# Altium project PCB_Project.PrjPcb
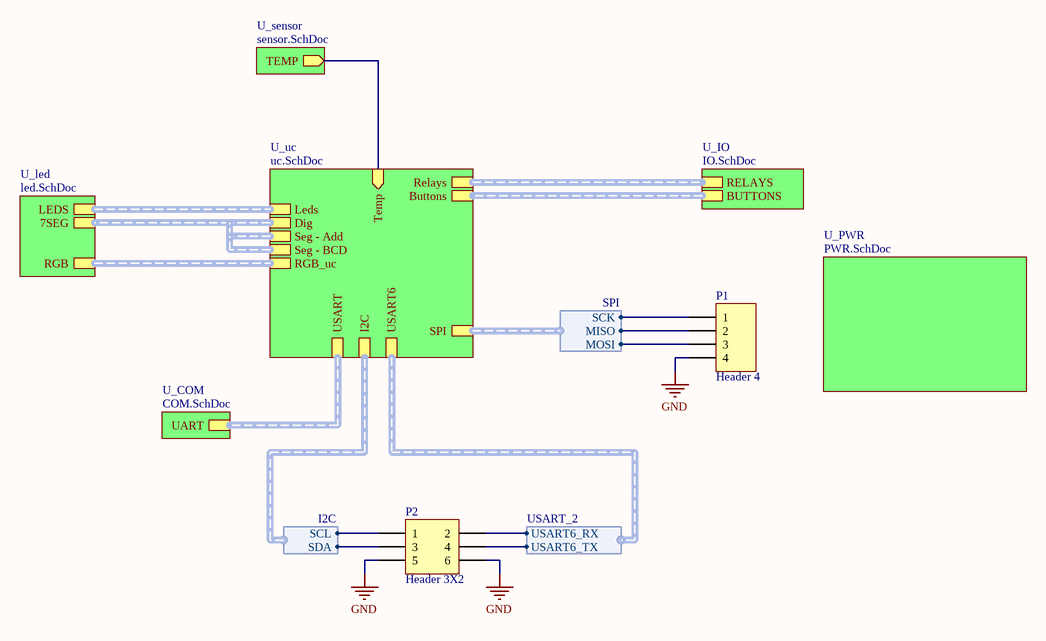
[diagram p0: extension.SchDoc]
7 sheets, 166 parts. Net scope: hierarchical (ports join the sheet entries above them; power ports are global).
Board file: extensionV1.0.PcbDoc
Sheets:
  extension.SchDoc
    U_IO = IO.SchDoc
    U_led = led.SchDoc
    U_COM = COM.SchDoc
    U_uc = uc.SchDoc
    U_sensor = sensor.SchDoc
    U_PWR = PWR.SchDoc

## Sheet extension.SchDoc
size A3

### Parts
P1  Header 4  [HDR1X4]
P2  Header 3X2  [HDR2X3]

### Sub-sheets
U_COM = COM.SchDoc: UART (harness UART)
U_IO = IO.SchDoc: RELAYS (harness Relays), BUTTONS (harness Buttons)
U_led = led.SchDoc: LEDS (harness LEDS), 7SEG (harness 7SEG), RGB (harness RGB)
U_PWR = PWR.SchDoc: no entries
U_sensor = sensor.SchDoc: TEMP (out)
U_uc = uc.SchDoc: USART (harness USART), Leds (harness Leds), Relays (harness Relays), Buttons (harness Buttons), Dig (harness DIG), Seg - Add (harness Seg Add), Seg - BCD (harness Seg BCD), I2C (harness I2C), SPI (harness SPI), USART6 (harness USART_2), RGB_uc (harness RGB), Temp (in)

### Harnesses
USART_2: USART6_TX, USART6_RX
SPI: MOSI, MISO, SCK
I2C: SDA, SCL

### Nets
GND: P1.4 P2.5 P2.6
MISO: P1.2 ; sheet U_uc/SPI.MISO
MOSI: P1.3 ; sheet U_uc/SPI.MOSI
SCK: P1.1 ; sheet U_uc/SPI.SCK
SCL: P2.1 ; sheet U_uc/I2C.SCL
SDA: P2.3 ; sheet U_uc/I2C.SDA
TEMP: sheet U_uc/Temp, sheet U_sensor/TEMP
USART6_RX: P2.2 ; sheet U_uc/USART6.USART6_RX
USART6_TX: P2.4 ; sheet U_uc/USART6.USART6_TX

### Buses and harness runs
harness sheet U_COM/UART = sheet U_uc/USART
harness sheet U_IO/BUTTONS = sheet U_uc/Buttons
harness sheet U_IO/RELAYS = sheet U_uc/Relays
harness sheet U_led/7SEG = sheet U_uc/Dig = sheet U_uc/Seg - Add = sheet U_uc/Seg - BCD
harness sheet U_led/LEDS = sheet U_uc/Leds
harness sheet U_led/RGB = sheet U_uc/RGB_uc

### Notes on the sheet
- 1
- 2
- 3
- 4
- 5
- 6
- 7
- 8
- A
- B
- C
- D
- Project:
- Date:
- Drawing number:
- Rev:
- Format:
- A3
- Drawn by:
- Laboratory:
- Page
- Sheet:
- of
- File:

### Library data of the parts
P1 = Header 4: Header, 4-Pin
P2 = Header 3X2: Header, 3-Pin, Dual row

## Sheet IO.SchDoc
size A3
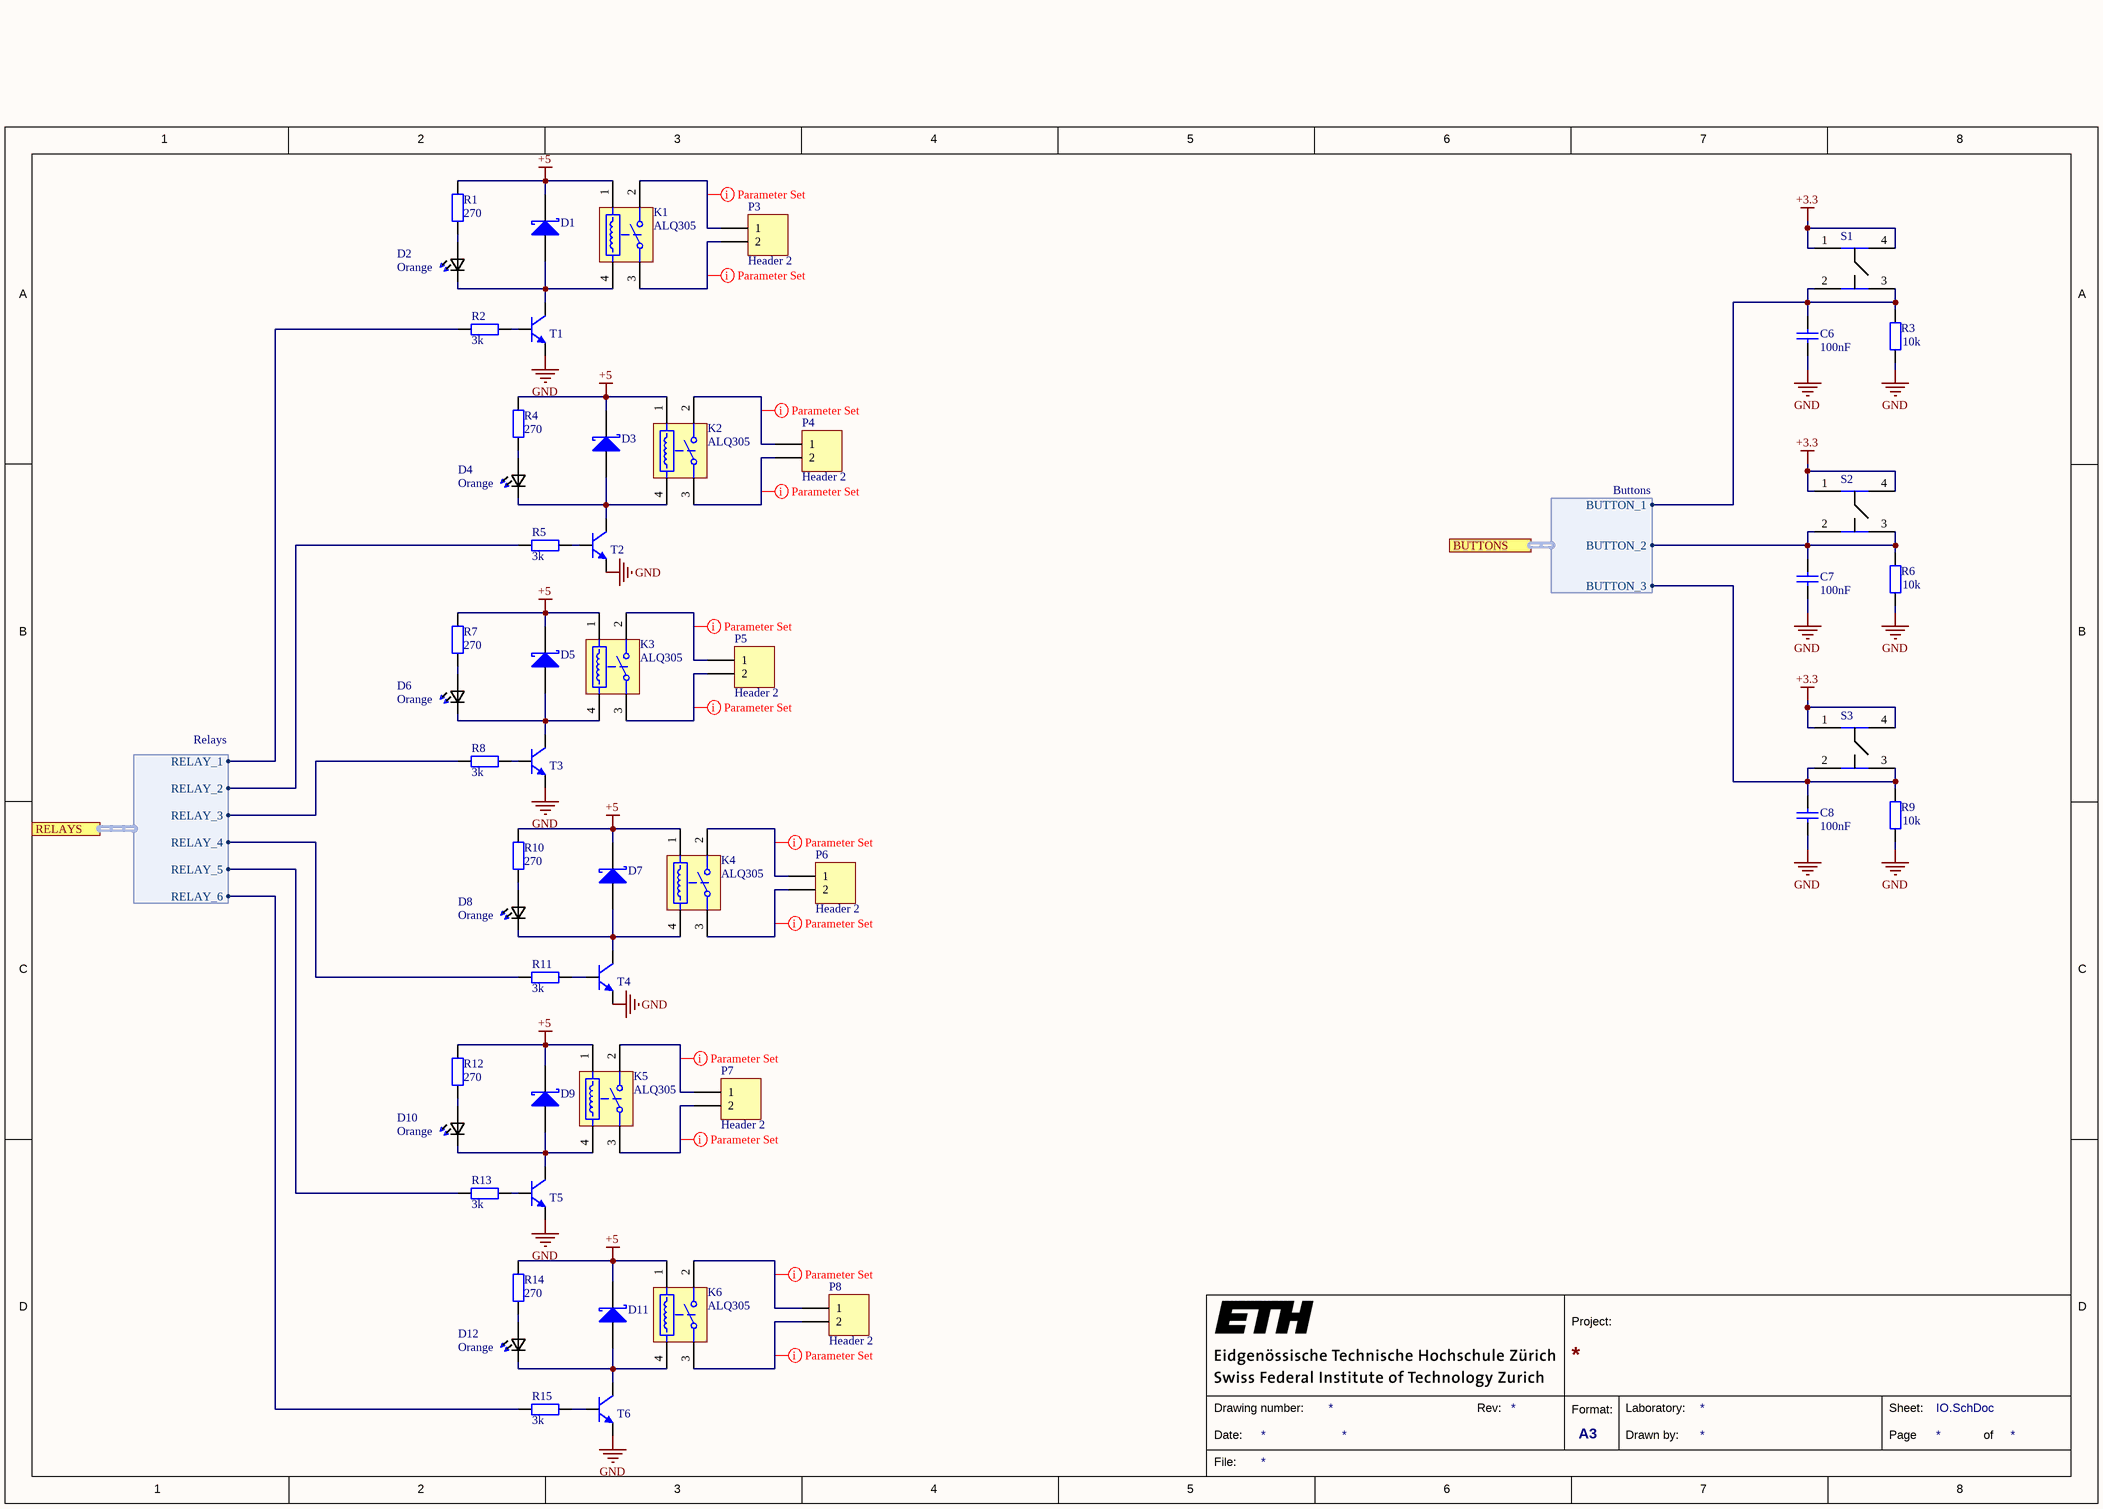
[diagram p1: IO.SchDoc]

### Parts
C6  100nF  [CAP_0603i_1608m -N]
C7  100nF  [CAP_0603i_1608m -N]
C8  100nF  [CAP_0603i_1608m -N]
D1  Diode  Schottky  [SOD123]  (value not drawn)
D2  Orange  [*0603]
D3  Diode  Schottky  [SOD123]  (value not drawn)
D4  Orange  [*0603]
D5  Diode  Schottky  [SOD123]  (value not drawn)
D6  Orange  [*0603]
D7  Diode  Schottky  [SOD123]  (value not drawn)
D8  Orange  [*0603]
D9  Diode  Schottky  [SOD123]  (value not drawn)
D10  Orange  [*0603]
D11  Diode  Schottky  [SOD123]  (value not drawn)
D12  Orange  [*0603]
K1  ALQ305  [PNSC-LQ-4-2000x1000x1600_V]
K2  ALQ305  [PNSC-LQ-4-2000x1000x1600_V]
K3  ALQ305  [PNSC-LQ-4-2000x1000x1600_V]
K4  ALQ305  [PNSC-LQ-4-2000x1000x1600_V]
K5  ALQ305  [PNSC-LQ-4-2000x1000x1600_V]
K6  ALQ305  [PNSC-LQ-4-2000x1000x1600_V]
P3  Header 2  [3.5MM Phoenix Contact 1984617]
P4  Header 2  [3.5MM Phoenix Contact 1984617]
P5  Header 2  [3.5MM Phoenix Contact 1984617]
P6  Header 2  [3.5MM Phoenix Contact 1984617]
P7  Header 2  [3.5MM Phoenix Contact 1984617]
P8  Header 2  [3.5MM Phoenix Contact 1984617]
R1  270  [RES_0603i_1608m -N]
R2  3k  [RES_0603i_1608m -N]
R3  10k  [RES_0603i_1608m -N]
R4  270  [RES_0603i_1608m -N]
R5  3k  [RES_0603i_1608m -N]
R6  10k  [RES_0603i_1608m -N]
R7  270  [RES_0603i_1608m -N]
R8  3k  [RES_0603i_1608m -N]
R9  10k  [RES_0603i_1608m -N]
R10  270  [RES_0603i_1608m -N]
R11  3k  [RES_0603i_1608m -N]
R12  270  [RES_0603i_1608m -N]
R13  3k  [RES_0603i_1608m -N]
R14  270  [RES_0603i_1608m -N]
R15  3k  [RES_0603i_1608m -N]
S1  EVQ-Q2U02W  [EVQQ2]  (value not drawn)
S2  EVQ-Q2U02W  [EVQQ2]  (value not drawn)
S3  EVQ-Q2U02W  [EVQQ2]  (value not drawn)
T1  Part Number: MMBT3904-7-F  [SOT-23-M]  (value not drawn)
T2  Part Number: MMBT3904-7-F  [SOT-23-M]  (value not drawn)
T3  Part Number: MMBT3904-7-F  [SOT-23-M]  (value not drawn)
T4  Part Number: MMBT3904-7-F  [SOT-23-M]  (value not drawn)
T5  Part Number: MMBT3904-7-F  [SOT-23-M]  (value not drawn)
T6  Part Number: MMBT3904-7-F  [SOT-23-M]  (value not drawn)

### Ports
BUTTONS (harness Buttons), RELAYS (harness Relays)

### Harnesses
Relays: RELAY_1, RELAY_2, RELAY_3, RELAY_4, RELAY_5, RELAY_6
Buttons: BUTTON_2, BUTTON_1, BUTTON_3

### Nets
+3.3: S1.1(NO_1) S1.4(NO_2) S2.1(NO_1) S2.4(NO_2) S3.1(NO_1) S3.4(NO_2)
+5: D1.2(K) D3.2(K) D5.2(K) D7.2(K) D9.2(K) D11.2(K) K1.1 K2.1 K3.1 K4.1 K5.1 K6.1 R1.2 R4.2 R7.2 R10.2 R12.2 R14.2  [project net  +5]
GND: C6.1 C7.1 C8.1 R3.1 R6.1 R9.1 T1.2(E) T2.2(E) T3.2(E) T4.2(E) T5.2(E) T6.2(E)
BUTTON_1: C6.2 R3.2 S1.2(COM_1) S1.3(COM_2) ; port BUTTONS.BUTTON_1
BUTTON_2: C7.2 R6.2 S2.2(COM_1) S2.3(COM_2) ; port BUTTONS.BUTTON_2
BUTTON_3: C8.2 R9.2 S3.2(COM_1) S3.3(COM_2) ; port BUTTONS.BUTTON_3
RELAY_1: R2.2 ; port RELAYS.RELAY_1
RELAY_2: R5.2 ; port RELAYS.RELAY_2
RELAY_3: R8.2 ; port RELAYS.RELAY_3
RELAY_4: R11.2 ; port RELAYS.RELAY_4
RELAY_5: R13.2 ; port RELAYS.RELAY_5
RELAY_6: R15.2 ; port RELAYS.RELAY_6
NetD1_1: D1.1(A) D2.1(K2) K1.4 T1.3(C)
NetD2_2: D2.2(A2) R1.1
NetD3_1: D3.1(A) D4.1(K2) K2.4 T2.3(C)
NetD4_2: D4.2(A2) R4.1
NetD5_1: D5.1(A) D6.1(K2) K3.4 T3.3(C)
NetD6_2: D6.2(A2) R7.1
NetD7_1: D7.1(A) D8.1(K2) K4.4 T4.3(C)
NetD8_2: D8.2(A2) R10.1
NetD9_1: D9.1(A) D10.1(K2) K5.4 T5.3(C)
NetD10_2: D10.2(A2) R12.1
NetD11_1: D11.1(A) D12.1(K2) K6.4 T6.3(C)
NetD12_2: D12.2(A2) R14.1
NetK1_2: K1.2(NO) P3.1
NetK1_3: K1.3(COM) P3.2
NetK2_2: K2.2(NO) P4.1
NetK2_3: K2.3(COM) P4.2
NetK3_2: K3.2(NO) P5.1
NetK3_3: K3.3(COM) P5.2
NetK4_2: K4.2(NO) P6.1
NetK4_3: K4.3(COM) P6.2
NetK5_2: K5.2(NO) P7.1
NetK5_3: K5.3(COM) P7.2
NetK6_2: K6.2(NO) P8.1
NetK6_3: K6.3(COM) P8.2
NetR2_1: R2.1 T1.1(B)
NetR5_1: R5.1 T2.1(B)
NetR8_1: R8.1 T3.1(B)
NetR11_1: R11.1 T4.1(B)
NetR13_1: R13.1 T5.1(B)
NetR15_1: R15.1 T6.1(B)

### Layout directives
rule Clearance Constraint [Clearance = 15.748mil]: NetK1_2, NetK1_3, NetK2_2, NetK2_3, NetK3_2, NetK3_3, NetK4_2, NetK4_3, NetK5_2, NetK5_3, NetK6_2, NetK6_3

### Notes on the sheet
- 1
- 2
- 3
- 4
- 5
- 6
- 7
- 8
- A
- B
- C
- D
- Project:
- Date:
- Drawing number:
- Rev:
- Format:
- A3
- Drawn by:
- Laboratory:
- Page
- Sheet:
- of
- File:

### Library data of the parts
C6-C8 = Cap: capacitor
D1 D3 D5 D7 D9 D11 = Diode  Schottky: Schottky Diode
D2 D4 D6 D8 D10 D12 = LTST-C191KFKT: / LED; SMD; 0603; orange; 45-90mcd; 1.6x0.8x0.55mm; 130Â°; 2Ã·2.4V; 20mA /; MF: Lite-On Inc.; Digi-Key_Purchase_URL: https://www.digikey.com/product-detail/en/lite-on-inc/LTST-C191KFKT/160-1445-1-ND/386832?utm_source=snapeda&utm_medium=aggregator&utm_campaign=symbol; SnapEDA_Link: https://www.snapeda.com/parts/LTST-C191KFKT/Lite-On%20Inc./view-part/?ref=snap; MP: LTST-C191KFKT; Digi-Key_Part_Number: 160-1445-1-ND; Package: 0603 Lite-On; Value: *
K1-K6 = CMP-1503-00188-1: LQ Relays, 5 V Coil Voltage, 200 mW Nominal Operating Power, -40 to 85 degC, 4-Pin LQ, Carton, Case, RoHS; Manufacturer: Panasonic; Pb-Free: True; Nominal Operating Power: 200 mW; Max Switching Voltage: 250 V AC; Coil Voltage: 5 V; Max Switching Current: 10 A (N.O.), 3 A (N.C.); Mechanical Life(Min.operation): 1x10^7; Electrical Life: 5x10^4; ComponentLink2URL: http://www3.panasonic.biz/ac/e_download/control/relay/power/catalog/mech_eng_lq.pdf?f_cd=401220; ComponentLink3Description: Package Specification; PartNumber: ALQ305; PackageDescription: 4-Pin Through Hole Terminal Package, Body 20 x 10 mm; Packing: Carton, Case; ComponentLink2Description: Datasheet; ComponentLink1URL: http://www3.panasonic.biz/ac/ae/index.jsp; PackageReference: LQ-4-2000x1000x1600; DatasheetVersion: 201410-T; Mounting Technology: Through Hole; RoHS: True; ComponentLink3URL: http://www3.panasonic.biz/ac/e_download/control/relay/power/catalog/mech_eng_lq.pdf?f_cd=401220; ComponentLink1Description: Manufacturer URL; PackageVersion: ASCTB92E, 10/2014; Series: LQ Relays
P3-P8 = Header 2: Header, 2-Pin
R1-R15 = Res: Resistor
S1-S3 = EVQ-Q2U02W: White Button Tactile Switch, Single Pole Single Throw (SPST) 20 mA @ 15 V dc 0.7mm; Manufacturer_Name: Panasonic; Mouser Part Number: 667-EVQ-Q2U02W; Mouser Price/Stock: https://www.mouser.com/Search/Refine.aspx?Keyword=667-EVQ-Q2U02W; Manufacturer_Part_Number: EVQ-Q2U02W; Datasheet Link: https://componentsearchengine.com/Datasheets/1/EVQ-Q2U02W.pdf
T1-T6 = MMBT3904-7-F: No Description Available; Vendor: Diodes Inc; Built_By: EMA_UL_Team; Type: DEV; Manufacturer_Part_Number: MMBT3904-7-F; Copyright: Copyright (C) 2018 Accelerated Designs. All rights reserved; RefDes: RefDes; Value: Value

## Sheet led.SchDoc
size A3
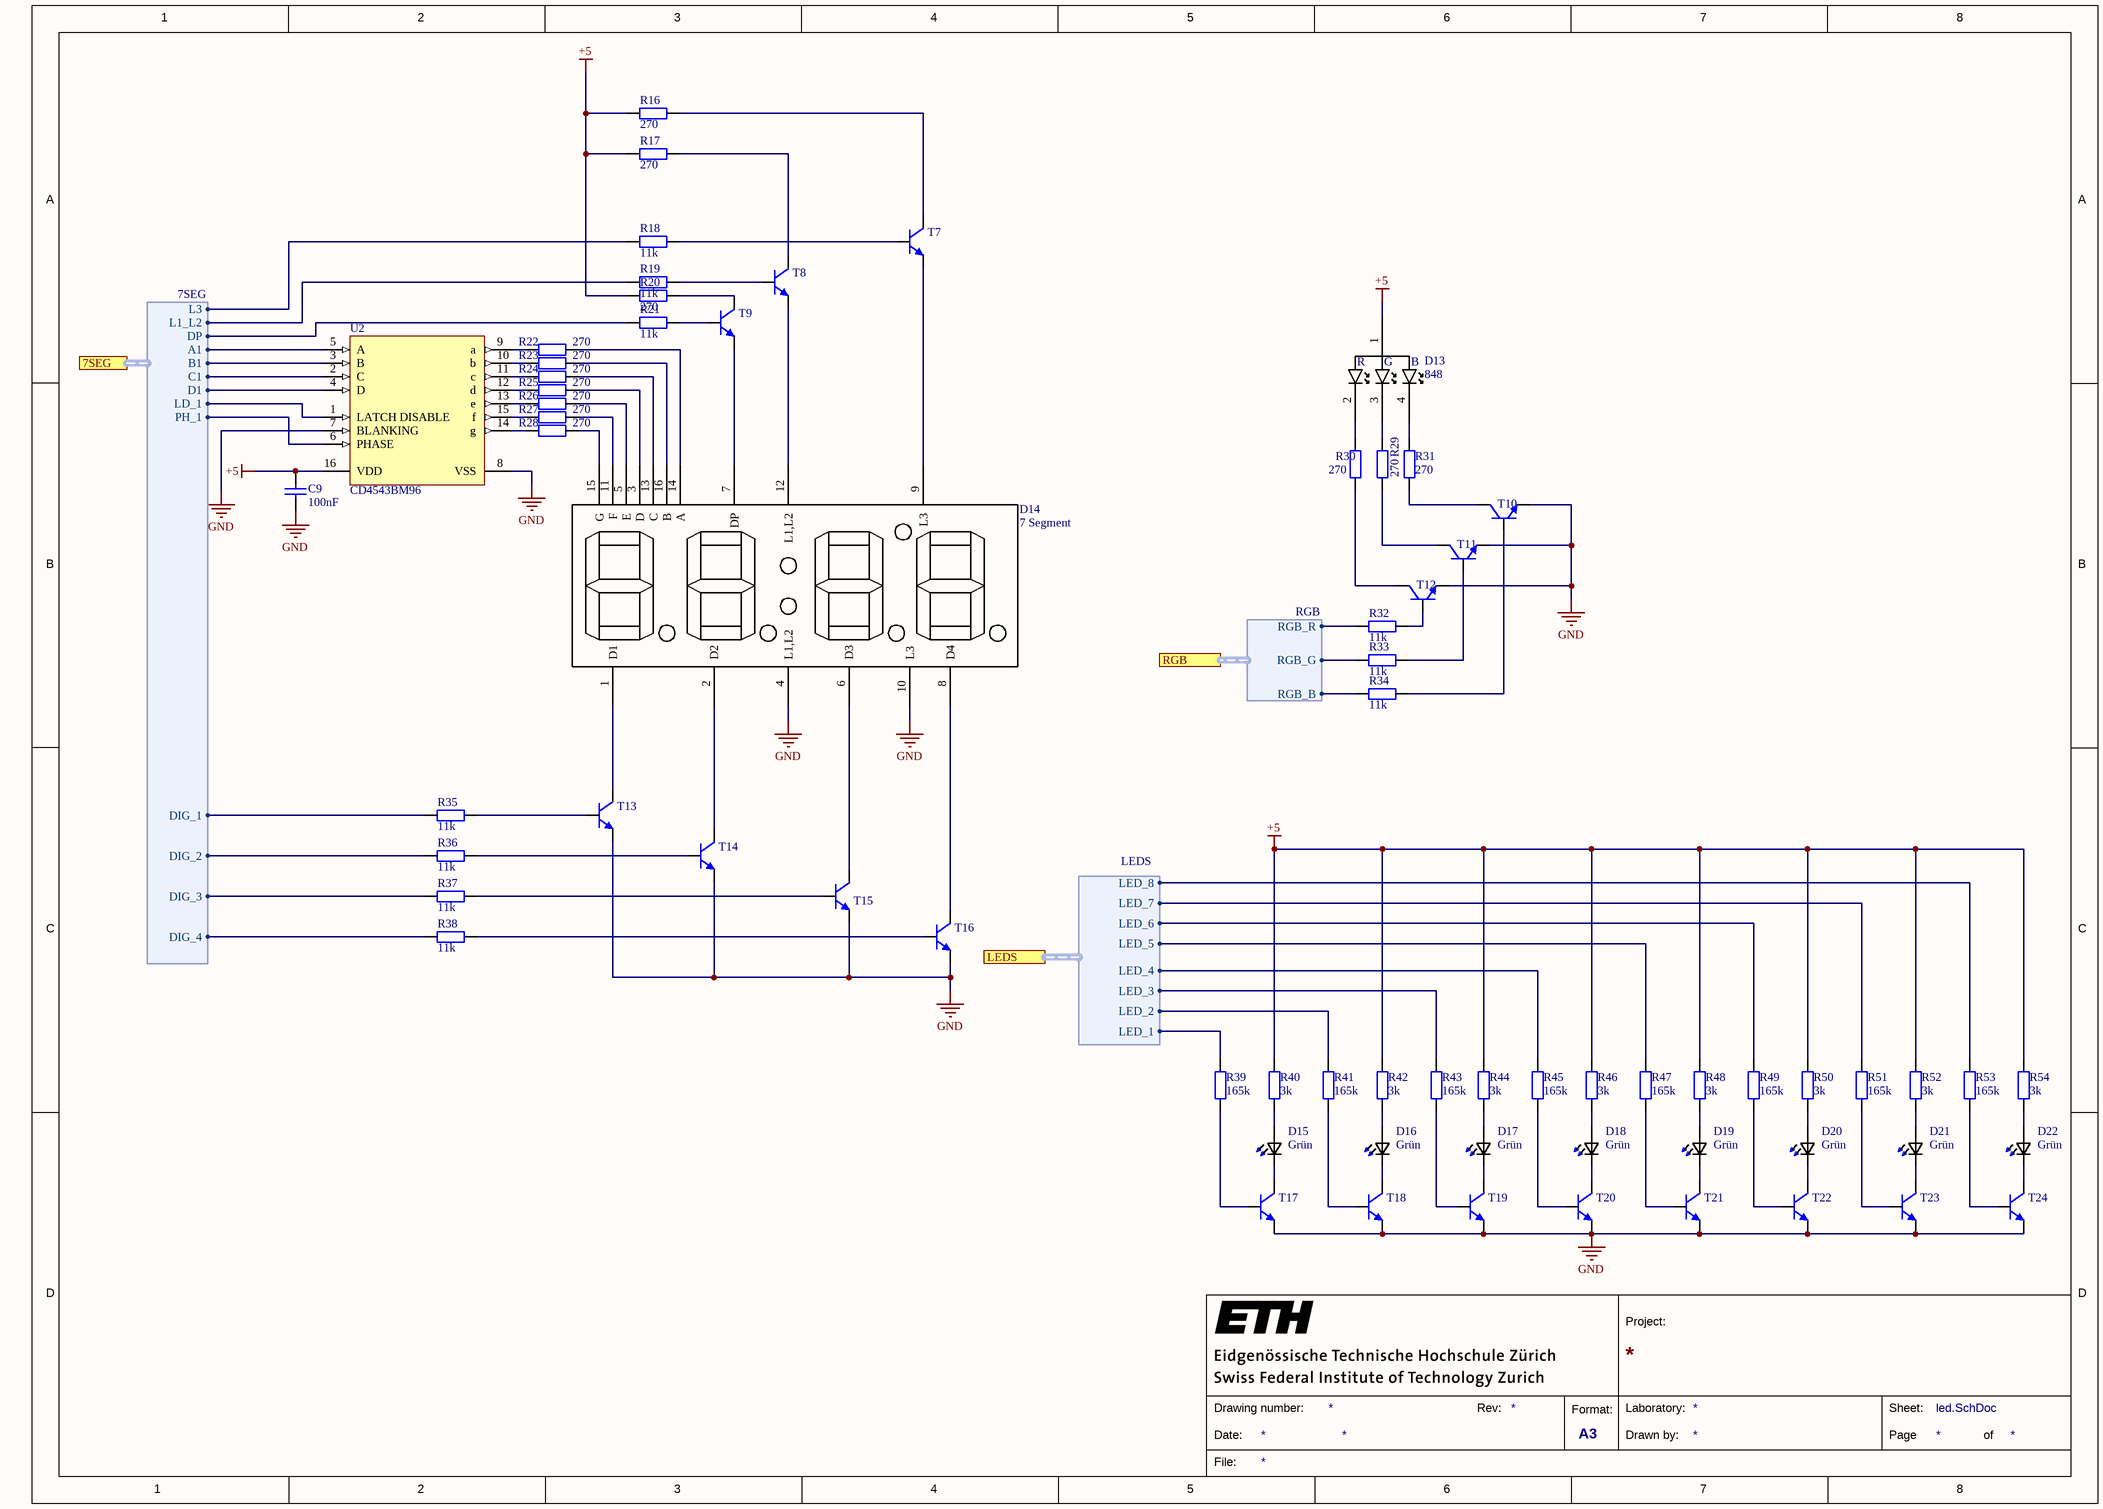
[diagram p2: led.SchDoc]

### Parts
C9  100nF  [CAP_0603i_1608m -N]
D13  848  [Adafruit-848]
D14  7 Segment  [TDCG1060M]
D15  Grün  [*0603]
D16  Grün  [*0603]
D17  Grün  [*0603]
D18  Grün  [*0603]
D19  Grün  [*0603]
D20  Grün  [*0603]
D21  Grün  [*0603]
D22  Grün  [*0603]
R16  270  [RES_0603i_1608m -N]
R17  270  [RES_0603i_1608m -N]
R18  11k  [RES_0603i_1608m -N]
R19  11k  [RES_0603i_1608m -N]
R20  270  [RES_0603i_1608m -N]
R21  11k  [RES_0603i_1608m -N]
R22  270  [RES_0603i_1608m -N]
R23  270  [RES_0603i_1608m -N]
R24  270  [RES_0603i_1608m -N]
R25  270  [RES_0603i_1608m -N]
R26  270  [RES_0603i_1608m -N]
R27  270  [RES_0603i_1608m -N]
R28  270  [RES_0603i_1608m -N]
R29  270  [RES_0603i_1608m -N]
R30  270  [RES_0603i_1608m -N]
R31  270  [RES_0603i_1608m -N]
R32  11k  [RES_0603i_1608m -N]
R33  11k  [RES_0603i_1608m -N]
R34  11k  [RES_0603i_1608m -N]
R35  11k  [RES_0603i_1608m -N]
R36  11k  [RES_0603i_1608m -N]
R37  11k  [RES_0603i_1608m -N]
R38  11k  [RES_0603i_1608m -N]
R39  165k  [RES_0603i_1608m -N]
R40  3k  [RES_0603i_1608m -N]
R41  165k  [RES_0603i_1608m -N]
R42  3k  [RES_0603i_1608m -N]
R43  165k  [RES_0603i_1608m -N]
R44  3k  [RES_0603i_1608m -N]
R45  165k  [RES_0603i_1608m -N]
R46  3k  [RES_0603i_1608m -N]
R47  165k  [RES_0603i_1608m -N]
R48  3k  [RES_0603i_1608m -N]
R49  165k  [RES_0603i_1608m -N]
R50  3k  [RES_0603i_1608m -N]
R51  165k  [RES_0603i_1608m -N]
R52  3k  [RES_0603i_1608m -N]
R53  165k  [RES_0603i_1608m -N]
R54  3k  [RES_0603i_1608m -N]
T7  Part Number: MMBT3904-7-F  [SOT-23-M]  (value not drawn)
T8  Part Number: MMBT3904-7-F  [SOT-23-M]  (value not drawn)
T9  Part Number: MMBT3904-7-F  [SOT-23-M]  (value not drawn)
T10  Part Number: MMBT3904-7-F  [SOT-23-M]  (value not drawn)
T11  Part Number: MMBT3904-7-F  [SOT-23-M]  (value not drawn)
T12  Part Number: MMBT3904-7-F  [SOT-23-M]  (value not drawn)
T13  Part Number: MMBT3904-7-F  [SOT-23-M]  (value not drawn)
T14  Part Number: MMBT3904-7-F  [SOT-23-M]  (value not drawn)
T15  Part Number: MMBT3904-7-F  [SOT-23-M]  (value not drawn)
T16  Part Number: MMBT3904-7-F  [SOT-23-M]  (value not drawn)
T17  Part Number: MMBT3904-7-F  [SOT-23-M]  (value not drawn)
T18  Part Number: MMBT3904-7-F  [SOT-23-M]  (value not drawn)
T19  Part Number: MMBT3904-7-F  [SOT-23-M]  (value not drawn)
T20  Part Number: MMBT3904-7-F  [SOT-23-M]  (value not drawn)
T21  Part Number: MMBT3904-7-F  [SOT-23-M]  (value not drawn)
T22  Part Number: MMBT3904-7-F  [SOT-23-M]  (value not drawn)
T23  Part Number: MMBT3904-7-F  [SOT-23-M]  (value not drawn)
T24  Part Number: MMBT3904-7-F  [SOT-23-M]  (value not drawn)
U2  CD4543BM96  [D0016A_L]

### Ports
7SEG (harness 7SEG), LEDS (harness LEDS), RGB (harness RGB)

### Harnesses
LEDS: LED_5, LED_4, LED_3, LED_2, LED_1, LED_6, LED_7, LED_8
7SEG: PH_1, LD_1, D1, C1, B1, A1, DP, L1_L2, L3, DIG_1, DIG_2, DIG_3, DIG_4
RGB: RGB_R, RGB_G, RGB_B

### Nets
+5: C9.2 D13.1 R16.2 R17.2 R20.1 R40.2 R42.2 R44.2 R46.2 R48.2 R50.2 R52.2 R54.2 U2.16(VDD)  [project net  +5]
GND: C9.1 D14.4(L1,L2) D14.10(L3) T10.2(E) T11.2(E) T12.2(E) T13.2(E) T14.2(E) T15.2(E) T16.2(E) T17.2(E) T18.2(E) T19.2(E) T20.2(E) T21.2(E) T22.2(E) T23.2(E) T24.2(E) U2.7(BLANKING) U2.8(VSS)
A1: U2.5(A) ; port 7SEG.A1
B1: U2.3(B) ; port 7SEG.B1
C1: U2.2(C) ; port 7SEG.C1
D1: U2.4(D) ; port 7SEG.D1
DIG_1: R35.1 ; port 7SEG.DIG_1
DIG_2: R36.1 ; port 7SEG.DIG_2
DIG_3: R37.1 ; port 7SEG.DIG_3
DIG_4: R38.1 ; port 7SEG.DIG_4
DP: R21.1 ; port 7SEG.DP
L1_L2: R19.2 ; port 7SEG.L1_L2
L3: R18.2 ; port 7SEG.L3
LD_1: U2.1(LATCH_DISABLE) ; port 7SEG.LD_1
LED_1: R39.2 ; port LEDS.LED_1
LED_2: R41.2 ; port LEDS.LED_2
LED_3: R43.2 ; port LEDS.LED_3
LED_4: R45.2 ; port LEDS.LED_4
LED_5: R47.2 ; port LEDS.LED_5
LED_6: R49.2 ; port LEDS.LED_6
LED_7: R51.2 ; port LEDS.LED_7
LED_8: R53.2 ; port LEDS.LED_8
PH_1: U2.6(PHASE) ; port 7SEG.PH_1
RGB_B: R34.1 ; port RGB.RGB_B
RGB_G: R33.1 ; port RGB.RGB_G
RGB_R: R32.1 ; port RGB.RGB_R
NetD13_2: D13.2 R30.2
NetD13_3: D13.3 R29.2
NetD13_4: D13.4 R31.2
NetD14_1: D14.1(D1) T13.3(C)
NetD14_2: D14.2(D2) T14.3(C)
NetD14_3: D14.3(D) R25.1
NetD14_5: D14.5(E) R26.1
NetD14_6: D14.6(D3) T15.3(C)
NetD14_7: D14.7(DP) T9.2(E)
NetD14_8: D14.8(D4) T16.3(C)
NetD14_9: D14.9(L3) T7.2(E)
NetD14_11: D14.11(F) R27.1
NetD14_12: D14.12(L1,L2) T8.2(E)
NetD14_13: D14.13(C) R24.1
NetD14_14: D14.14(A) R22.1
NetD14_15: D14.15(G) R28.1
NetD14_16: D14.16(B) R23.1
NetD15_1: D15.1(K2) T17.3(C)
NetD15_2: D15.2(A2) R40.1
NetD16_1: D16.1(K2) T18.3(C)
NetD16_2: D16.2(A2) R42.1
NetD17_1: D17.1(K2) T19.3(C)
NetD17_2: D17.2(A2) R44.1
NetD18_1: D18.1(K2) T20.3(C)
NetD18_2: D18.2(A2) R46.1
NetD19_1: D19.1(K2) T21.3(C)
NetD19_2: D19.2(A2) R48.1
NetD20_1: D20.1(K2) T22.3(C)
NetD20_2: D20.2(A2) R50.1
NetD21_1: D21.1(K2) T23.3(C)
NetD21_2: D21.2(A2) R52.1
NetD22_1: D22.1(K2) T24.3(C)
NetD22_2: D22.2(A2) R54.1
NetR16_1: R16.1 T7.3(C)
NetR17_1: R17.1 T8.3(C)
NetR18_1: R18.1 T7.1(B)
NetR19_1: R19.1 T8.1(B)
NetR20_2: R20.2 T9.3(C)
NetR21_2: R21.2 T9.1(B)
NetR22_2: R22.2 U2.9(a)
NetR23_2: R23.2 U2.10(b)
NetR24_2: R24.2 U2.11(c)
NetR25_2: R25.2 U2.12(d)
NetR26_2: R26.2 U2.13(e)
NetR27_2: R27.2 U2.15(f)
NetR28_2: R28.2 U2.14(g)
NetR29_1: R29.1 T11.3(C)
NetR30_1: R30.1 T12.3(C)
NetR31_1: R31.1 T10.3(C)
NetR32_2: R32.2 T12.1(B)
NetR33_2: R33.2 T11.1(B)
NetR34_2: R34.2 T10.1(B)
NetR35_2: R35.2 T13.1(B)
NetR36_2: R36.2 T14.1(B)
NetR37_2: R37.2 T15.1(B)
NetR38_2: R38.2 T16.1(B)
NetR39_1: R39.1 T17.1(B)
NetR41_1: R41.1 T18.1(B)
NetR43_1: R43.1 T19.1(B)
NetR45_1: R45.1 T20.1(B)
NetR47_1: R47.1 T21.1(B)
NetR49_1: R49.1 T22.1(B)
NetR51_1: R51.1 T23.1(B)
NetR53_1: R53.1 T24.1(B)

### Notes on the sheet
- 1
- 2
- 3
- 4
- 5
- 6
- 7
- 8
- A
- B
- C
- D
- Project:
- Date:
- Drawing number:
- Rev:
- Format:
- A3
- Drawn by:
- Laboratory:
- Page
- Sheet:
- of
- File:
- (in symbol Adafruit-848) R; G; B

### Library data of the parts
C9 = Cap: capacitor
D13 = Adafruit-848
D14 = TDCG1060M
D15-D22 = LTST-C191KGKT: / LED; SMD; 0603; grün; 35mcd; 1.6x0.8x0.55mm; 130Â°; 2Ã·2.V; 20mA /; MF: Lite-On Inc.; Digi-Key_Purchase_URL: https://www.digikey.ch/product-detail/de/lite-on-inc/LTST-C191KGKT/160-1446-1-ND/386834; SnapEDA_Link: https://www.snapeda.com/parts/LTST-C191KFKT/Lite-On%20Inc./view-part/?ref=snap; MP: LTST-C191KGKT; Digi-Key_Part_Number: 160-1446-1-ND; Package: 0603 Lite-On; Value: *
R16-R54 = Res: Resistor
T7-T24 = MMBT3904-7-F: as T1 on sheet IO; Manufacturer_Part_Number: MMBT3904-7-F; Copyright: Copyright (C) 2018 Accelerated Designs. All rights reserved; RefDes: RefDes; Value: Value
U2 = CMP-0388-00008-2: CMOS BCD-to-7-Segment Latch / Decoder / Driver for Liquid-Crystal Displays, 3 V, -55 to 125 degC, 16-pin SOIC (D16), Green (RoHS & no Sb/Br); Manufacturer: Texas Instruments; Vin(Min)(V): 3; SubFamily: Discrete Segment LED Driver; Rating: Catalog; ComponentLink2URL: http://www.ti.com/general/docs/lit/getliterature.tsp?genericPartNumber=CD4543B&fileType=pdf; ComponentLink1URL: http://www.ti.com/; PartNumber: CD4543BM96; ComponentLink3URL: http://www.ti.com/litv/pdf/mpds178g; Mounting Technology: Surface Mount; DatasheetVersion: SCHS086D; Code_JEDEC: MS-012; PackageDescription: 16-Pin Plastic Small Outline, Body 9.90 x 3.90 mm, Pitch 1.27 mm; ComponentLink1Description: Manufacturer URL; ComponentLink3Description: Package Specification; PackageVersion: 4040047-6/M; Eco-Plan: Green (RoHS & no Sb/Br); ComponentLink2Description: Datasheet; PackageReference: D0016A

## Sheet COM.SchDoc
size A3
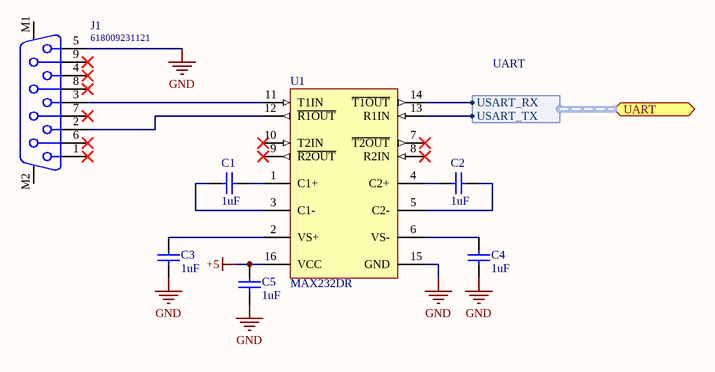
[diagram p3: COM.SchDoc]

### Parts
C1  1uF  [CAP_0603i_1608m -N]
C2  1uF  [CAP_0603i_1608m -N]
C3  1uF  [CAP_0603i_1608m -N]
C4  1uF  [CAP_0603i_1608m -N]
C5  1uF  [CAP_0603i_1608m -N]
J1  618009231121  [618009231121]
U1  MAX232DR  [D0016A_N]

### Ports
UART (bidir, harness UART)

### Harnesses
UART: USART_RX, USART_TX

### Nets
 +5: C5.2 U1.16(VCC)
GND: C3.1 C4.1 C5.1 J1.5 U1.15(GND)
USART_RX: U1.14(~{T1OUT}) ; port UART.USART_RX
USART_TX: U1.13(R1IN) ; port UART.USART_TX
NetC1_1: C1.1 U1.1(C1+)
NetC1_2: C1.2 U1.3(C1-)
NetC2_1: C2.1 U1.5(C2-)
NetC2_2: C2.2 U1.4(C2+)
NetC3_2: C3.2 U1.2(VS+)
NetC4_2: C4.2 U1.6(VS-)
NetJ1_2: J1.2 U1.12(~{R1OUT})
NetJ1_3: J1.3 U1.11(T1IN)

Not connected (* = marked no-connect by the designer): J1 1* 4* 6* 7* 8* 9* M1 M2; U1 7(~{T2OUT})* 8(R2IN)* 9(~{R2OUT})* 10(T2IN)*

### Notes on the sheet
- 1
- 2
- 3
- 4
- 5
- 6
- 7
- 8
- A
- B
- C
- D
- Project:
- Date:
- Drawing number:
- Rev:
- Format:
- A3
- Drawn by:
- Laboratory:
- Page
- Sheet:
- of
- File:

### Library data of the parts
C1-C5 = Cap: capacitor
J1 = CMP-1502-00200-1: Female PCB Connector with Hex Screw WR-DSUB, 8.08 mm, Angled, 9 pins; Manufacturer: Wurth Elektronik; Contact Resistance: 30mOhm; Pin Number: 9; Working Voltage: 125VAC; Rated Current: 3A; Gender: Female; Datasheet URL: https://katalog.we-online.de/em/datasheet/6180xx231121.pdf; Packaging: Tray; Package Reference: 618009231121; Operating Temperature: -40to85degC; Manufacturer URL: http://www.we-online.de; Publisher: WurthElektronik; Mounting Technology: THT; Part Number: 618009231121; Orientation: Angled
U1 = CMP-0299-00150-2: Dual EIA-232 Driver / Receiver, 0 to 70 degC, 16-Pin SOIC (D), Green (RoHS & no Sb/Br); Single Supply: TRUE; Supply Voltage(s)(V): 5; SubFamily: RS-232; Drivers Per Package: 2; ICC(Max)(mA): 10; ESD HBM(kV): +/-2; ComponentLink1Description: Manufacturer URL; ComponentLink2Description: Datasheet; RS-232: TRUE; ComponentLink3URL: http://www.ti.com/litv/pdf/mpds178g; DatasheetVersion: SLLS047L; ComponentLink1URL: www.ti.com; PackageDescription: 16-Pin Plastic Small Outline Integrated Circuit, 9.9 x 3.9 mm, Pitch 1.27 mm Pitch; PackageVersion: revM, Jun-2011; ComponentLink2URL: http://www.ti.com/general/docs/lit/getliterature.tsp?genericPartNumber=MAX232&fileType=pdf; ComponentLink3Description: Package Specification; PackageReference: D0016A; Receivers Per Package: 2

## Sheet uc.SchDoc
size A3
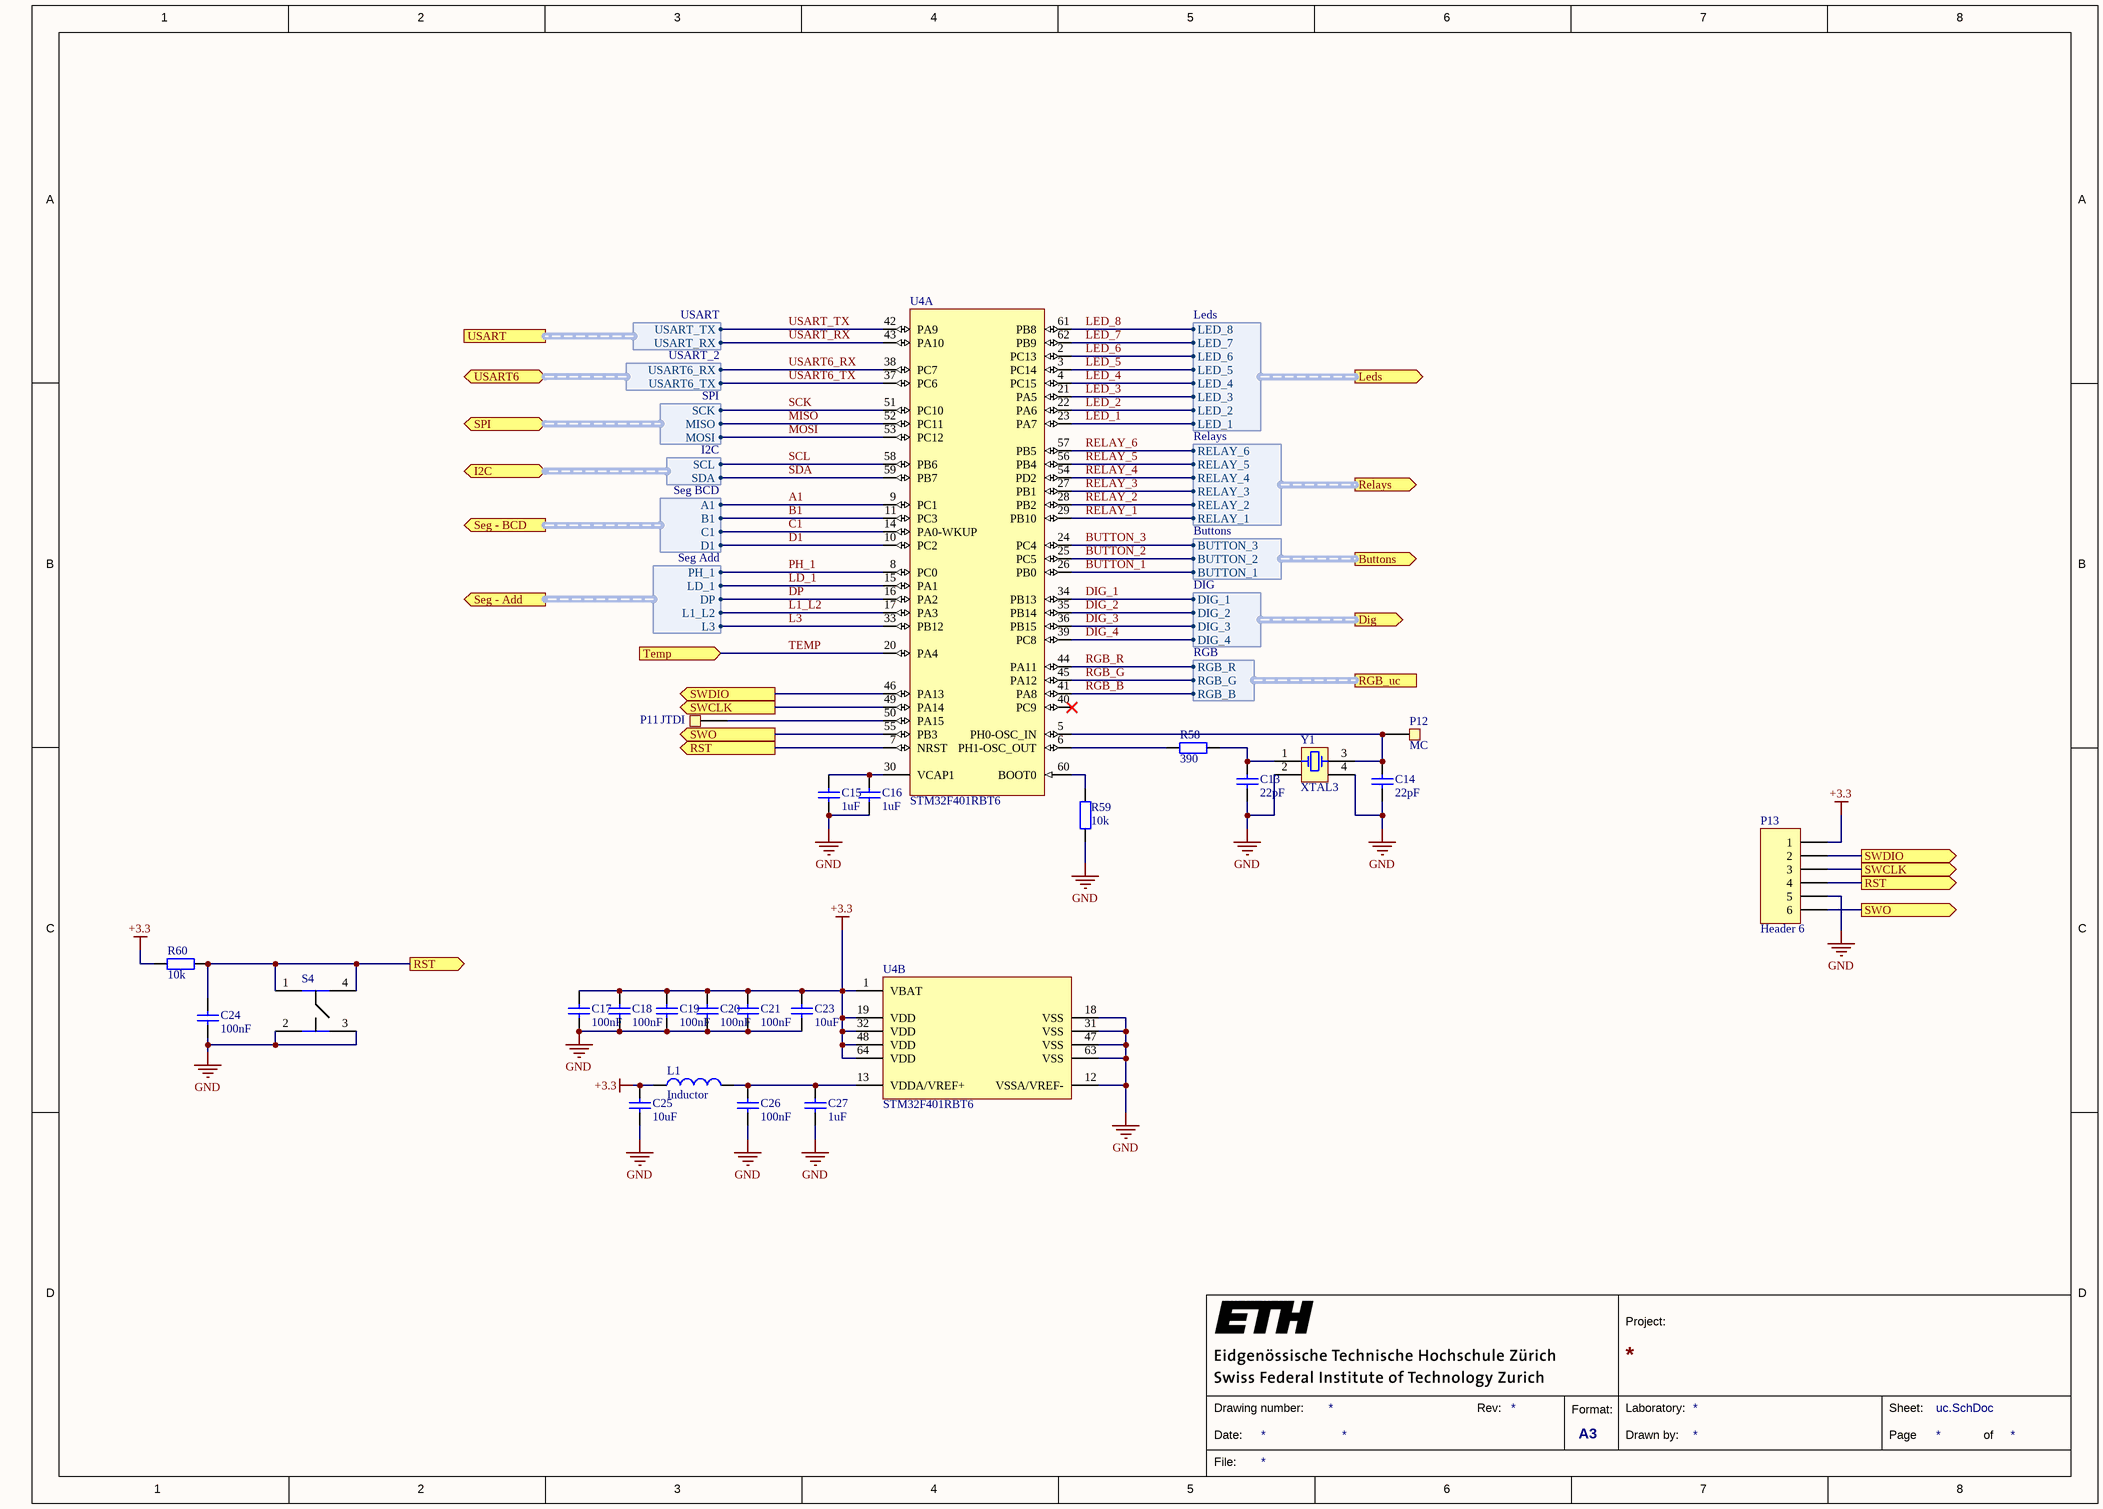
[diagram p4: uc.SchDoc]

### Parts
C13  22pF  [CAP_0603i_1608m -N]
C14  22pF  [CAP_0603i_1608m -N]
C15  1uF  [CAP_0603i_1608m -N]
C16  1uF  [CAP_0603i_1608m -N]
C17  100nF  [CAP_0603i_1608m -N]
C18  100nF  [CAP_0603i_1608m -N]
C19  100nF  [CAP_0603i_1608m -N]
C20  100nF  [CAP_0603i_1608m -N]
C21  100nF  [CAP_0603i_1608m -N]
C23  10uF  [CAP_0805i_2012m -N]
C24  100nF  [CAP_0603i_1608m -N]
C25  10uF  [CAP_0805i_2012m -N]
C26  100nF  [CAP_0603i_1608m -N]
C27  1uF  [CAP_0603i_1608m -N]
L1  Inductor  [IND_0603i_1608m -L]
P11  JTDI  [Pad_0603]
P12  MC  [Pad_3x3mm]
P13  Header 6  [HDR1X6]
R58  390  [RES_0805i_2012m -N]
R59  10k  [RES_0603i_1608m -N]
R60  10k  [RES_0603i_1608m -N]
S4  EVQ-Q2U02W  [EVQQ2]  (value not drawn)
U4  STM32F401RBT6  [STM-LQFP64_L]  (parts A,B of 2)
Y1  XTAL3  [TSX-3225 2*2.5]

### Ports
Buttons (out, harness Buttons), Dig (out, harness DIG), I2C (bidir, harness I2C), Leds (out, harness Leds), Relays (out, harness Relays), RGB_uc (harness RGB), RST (out), Seg - Add (out, harness Seg Add), Seg - BCD (out, harness Seg BCD), SPI (bidir, harness SPI), SWCLK (out), SWDIO (out), SWO (out), Temp (in), USART6 (bidir, harness USART_2), USART (harness USART)

### Harnesses
USART: USART_RX, USART_TX
USART_2: USART6_TX, USART6_RX
SPI: MOSI, MISO, SCK
I2C: SDA, SCL
Seg BCD: D1, C1, B1, A1
Seg Add: L3, L1_L2, DP, LD_1, PH_1
Leds: LED_1, LED_2, LED_3, LED_4, LED_5, LED_6, LED_7, LED_8
Relays: RELAY_1, RELAY_2, RELAY_3, RELAY_4, RELAY_5, RELAY_6
Buttons: BUTTON_3, BUTTON_2, BUTTON_1
DIG: DIG_4, DIG_3, DIG_2, DIG_1
RGB: RGB_R, RGB_G, RGB_B

### Nets
+3.3: C17.1 C18.2 C19.2 C20.1 C21.2 C23.2 C25.2 L1.2 P13.1 R60.1 U4.1(VBAT) U4.19(VDD) U4.32(VDD) U4.48(VDD) U4.64(VDD)
GND: C13.1 C14.1 C15.1 C16.1 C17.2 C18.1 C19.1 C20.2 C21.1 C23.1 C24.1 C25.1 C26.1 C27.1 P13.5 R59.1 S4.2(COM_1) S4.3(COM_2) U4.12(VSSA/VREF-) U4.18(VSS) U4.31(VSS) U4.47(VSS) U4.63(VSS) Y1.2(COM) Y1.4(COM)
A1: U4.9(PC1) ; port Dig.A1
B1: U4.11(PC3) ; port Dig.B1
BUTTON_1: U4.26(PB0) ; port Buttons.BUTTON_1
BUTTON_2: U4.25(PC5) ; port Buttons.BUTTON_2
BUTTON_3: U4.24(PC4) ; port Buttons.BUTTON_3
C1: U4.14(PA0-WKUP) ; port Dig.C1
D1: U4.10(PC2) ; port Dig.D1
DIG_1: U4.34(PB13) ; port Dig.DIG_1
DIG_2: U4.35(PB14) ; port Dig.DIG_2
DIG_3: U4.36(PB15) ; port Dig.DIG_3
DIG_4: U4.39(PC8) ; port Dig.DIG_4
DP: U4.16(PA2) ; port Dig.DP
L1_L2: U4.17(PA3) ; port Dig.L1_L2
L3: U4.33(PB12) ; port Dig.L3
LD_1: U4.15(PA1) ; port Dig.LD_1
LED_1: U4.23(PA7) ; port Leds.LED_1
LED_2: U4.22(PA6) ; port Leds.LED_2
LED_3: U4.21(PA5) ; port Leds.LED_3
LED_4: U4.4(PC15) ; port Leds.LED_4
LED_5: U4.3(PC14) ; port Leds.LED_5
LED_6: U4.2(PC13) ; port Leds.LED_6
LED_7: U4.62(PB9) ; port Leds.LED_7
LED_8: U4.61(PB8) ; port Leds.LED_8
MISO: U4.52(PC11) ; port SPI.MISO
MOSI: U4.53(PC12) ; port SPI.MOSI
PH_1: U4.8(PC0) ; port Dig.PH_1
RELAY_1: U4.29(PB10) ; port Relays.RELAY_1
RELAY_2: U4.28(PB2) ; port Relays.RELAY_2
RELAY_3: U4.27(PB1) ; port Relays.RELAY_3
RELAY_4: U4.54(PD2) ; port Relays.RELAY_4
RELAY_5: U4.56(PB4) ; port Relays.RELAY_5
RELAY_6: U4.57(PB5) ; port Relays.RELAY_6
RGB_B: U4.41(PA8) ; port RGB_uc.RGB_B
RGB_G: U4.45(PA12) ; port RGB_uc.RGB_G
RGB_R: U4.44(PA11) ; port RGB_uc.RGB_R
SCK: U4.51(PC10) ; port SPI.SCK
SCL: U4.58(PB6) ; port I2C.SCL
SDA: U4.59(PB7) ; port I2C.SDA
TEMP: U4.20(PA4) ; port Temp
USART6_RX: U4.38(PC7) ; port USART6.USART6_RX
USART6_TX: U4.37(PC6) ; port USART6.USART6_TX
USART_RX: U4.43(PA10) ; port USART.USART_RX
USART_TX: U4.42(PA9) ; port USART.USART_TX
NetC13_2: C13.2 R58.2 Y1.1(OSC1)
NetC14_2: C14.2 P12.1 U4.5(PH0-OSC_IN) Y1.3(OSC2)
NetC15_2: C15.2 C16.2 U4.30(VCAP1)
NetC24_2: C24.2 P13.4 R60.2 S4.1(NO_1) S4.4(NO_2) U4.7(NRST) ; port RST
NetC26_2: C26.2 C27.2 L1.1 U4.13(VDDA/VREF+)
NetP11_1: P11.1 U4.50(PA15)
NetP13_2: P13.2 U4.46(PA13) ; port SWDIO
NetP13_3: P13.3 U4.49(PA14) ; port SWCLK
NetP13_6: P13.6 U4.55(PB3) ; port SWO
NetR58_1: R58.1 U4.6(PH1-OSC_OUT)
NetR59_2: R59.2 U4.60(BOOT0)

Not connected (* = marked no-connect by the designer): U4 40(PC9)*

### Notes on the sheet
- 1
- 2
- 3
- 4
- 5
- 6
- 7
- 8
- A
- B
- C
- D
- Project:
- Date:
- Drawing number:
- Rev:
- Format:
- A3
- Drawn by:
- Laboratory:
- Page
- Sheet:
- of
- File:

### Library data of the parts
C13-C21 C23-C27 = Cap: capacitor
P11 P12 = Pad: Single Pad or Testpoint
P13 = Header 6: Header, 6-Pin
R58-R60 = Res: Resistor
S4 = EVQ-Q2U02W: as S1 on sheet IO; Mouser Part Number: 667-EVQ-Q2U02W; Mouser Price/Stock: https://www.mouser.com/Search/Refine.aspx?Keyword=667-EVQ-Q2U02W; Manufacturer_Part_Number: EVQ-Q2U02W; Datasheet Link: https://componentsearchengine.com/Datasheets/1/EVQ-Q2U02W.pdf
U4 = CMP-0243-00094-2: ARM Cortex-M4 32-bit MCU+FPU, 105 DMIPS, 128 kB Flash, 64 kB Internal RAM, 48 I/Os, 64-pin LQFP, -40 to 85 degC, Tray; Manufacturer: STMicroelectronics; Internal RAM Size (kB): 64; FLASH Size (Prog) (kB): 128; Supply Voltage(Vcc) max (V): 3.6; I/Os (High Current): 48; Supply Voltage(Vcc) min (V): 1.8; Operating Frequency(F) (Processor speed) (MHz): 84; Core: ARM Cortex-M4; PackageDescription: 64-Pin Low Profile Quad Flat Package, 10 x 10 mm Body, 0.5 mm Pitch; Mounting Technology: Surface Mount; PackageVersion: Rev. 4, 06/2013; ComponentLink1URL: http://www.st.com/web/en/home.html; ComponentLink3Description: Package Specification; ComponentLink2Description: Datasheet; ComponentLink3URL: http://www.st.com/st-web-ui/static/active/en/resource/technical/document/datasheet/DM00037051.pdf; ComponentLink2URL: http://www.st.com/st-web-ui/static/active/en/resource/technical/document/data_brief/DM00071938.pdf; DatasheetVersion: Rev. 1; Packing: Tray; PackageReference: LQFP64; PartNumber: STM32F401RBT6; ComponentLink1Description: Manufacturer URL
Y1 = XTAL3: Industrial Ceramic Resonator

## Sheet sensor.SchDoc
size A3
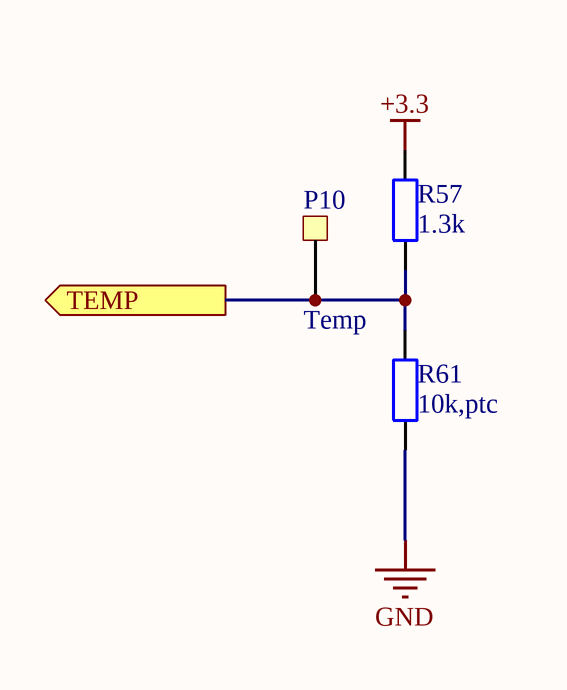
[diagram p5: sensor.SchDoc]

### Parts
P10  Temp  [Pad_3x3mm]
R57  1.3k  [RES_0603i_1608m -N]
R61  10k,ptc  [RES_0402i_1005m -N]

### Ports
TEMP (out)

### Nets
+3.3: R57.1
GND: R61.1
TEMP: P10.1 R57.2 R61.2 ; port TEMP

### Notes on the sheet
- 1
- 2
- 3
- 4
- 5
- 6
- 7
- 8
- A
- B
- C
- D
- Project:
- Date:
- Drawing number:
- Rev:
- Format:
- A3
- Drawn by:
- Laboratory:
- Page
- Sheet:
- of
- File:

### Library data of the parts
P10 = Pad: Single Pad or Testpoint
R57 = Res: Resistor
R61 = Res: temp sensor, ptc / 10k

## Sheet PWR.SchDoc
size A3
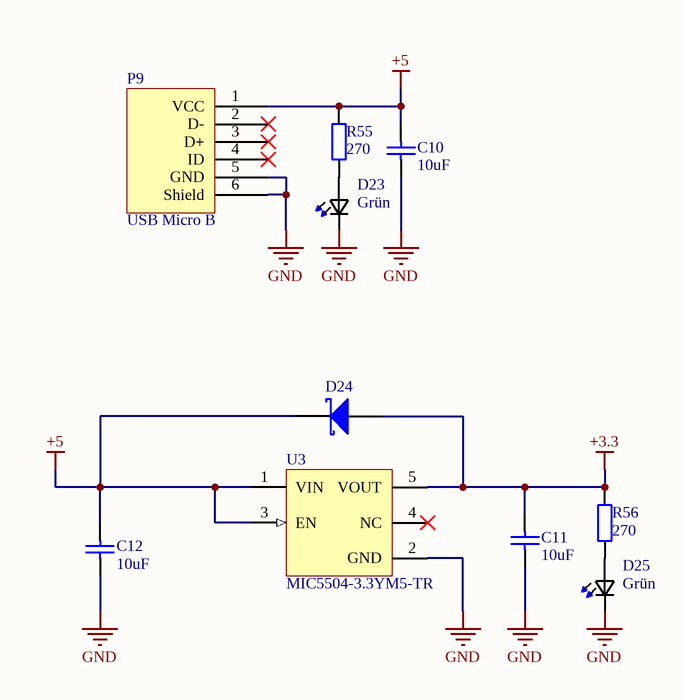
[diagram p6: PWR.SchDoc]

### Parts
C10  10uF  [CAP_0805i_2012m -N]
C11  10uF  [CAP_0805i_2012m -N]
C12  10uF  [CAP_0805i_2012m -N]
D23  Grün  [*0603]
D24  Diode  Schottky  [SOD123]  (value not drawn)
D25  Grün  [*0603]
P9  USB Micro B  [MCR-B-S-RA-SMT-EH4B-T/R]
R55  270  [RES_0603i_1608m -N]
R56  270  [RES_0603i_1608m -N]
U3  MIC5504-3.3YM5-TR  [MCHP-SOT-23-M5_V]

### Nets
+3.3: C11.2 D24.1(A) R56.2 U3.5(VOUT)
+5: C10.2 C12.2 D24.2(K) P9.1(VCC) R55.2 U3.1(VIN) U3.3(EN)  [project net  +5]
GND: C10.1 C11.1 C12.1 D23.1(K2) D25.1(K2) P9.5(GND) P9.6(Shield) U3.2(GND)
NetD23_2: D23.2(A2) R55.1
NetD25_2: D25.2(A2) R56.1

Not connected (* = marked no-connect by the designer): P9 2(D-)* 3(D+)* 4(ID)*; U3 4(NC)*

### Notes on the sheet
- 1
- 2
- 3
- 4
- 5
- 6
- 7
- 8
- A
- B
- C
- D
- Project:
- Date:
- Drawing number:
- Rev:
- Format:
- A3
- Drawn by:
- Laboratory:
- Page
- Sheet:
- of
- File:

### Library data of the parts
C10-C12 = Cap: capacitor
D23 D25 = LTST-C191KGKT: as D15 on sheet led; Digi-Key_Purchase_URL: https://www.digikey.ch/product-detail/de/lite-on-inc/LTST-C191KGKT/160-1446-1-ND/386834; SnapEDA_Link: https://www.snapeda.com/parts/LTST-C191KFKT/Lite-On%20Inc./view-part/?ref=snap; MP: LTST-C191KGKT; Digi-Key_Part_Number: 160-1446-1-ND; Package: 0603 Lite-On; Value: *
D24 = Diode  Schottky: Schottky Diode
P9 = USB Mikro B
R55 R56 = Res: Resistor
U3 = CMP-2000-07604-1: Single LDO, 2.5 to 5.5 V, Fixed Out 3.3 V, 0.3 A, -40 to 125 degC, 5-Pin SOT-23 (M5), RoHS, Tape and Reel; Manufacturer: Microchip; Number of Regulators: 1; Dropout Voltage: 160mV; Output Current: 300mA; Min Input Voltage: 2.5V; Nominal Output Voltage: 3.3V; Max Input Voltage: 5.5V; Min Current Limit: 400mA; Number of Pins: 5; RoHSCompliant: True; Min Operating Temperature: -40degC; Case\/Package: SOT-23; Datasheet URL: http://ww1.microchip.com/downloads/en/DeviceDoc/MIC550X.pdf; Package Description: 5-Pin Small Outline Transistor, Body 1.6 x 2.9 mm, Pitch 0.95 mm; Max Operating Temperature: 125degC; Packaging: CutTape; Manufacturer URL: http://www.microchip.com/; Package Reference: SOT-23; Mount: SurfaceMount; Output Voltage: 3.3V; Mounting Technology: SurfaceMount; Lead Free: LeadFree; REACH SVHC: NoSVHC; Datasheet Version: Rev. 2.3, 04/2015

## Nets that join several sheets
 +5: IO (18 pins), led (14 pins), COM (C5.2 U1.16), PWR (7 pins)
+3.3: IO (6 pins), uc (15 pins), sensor (R57.1), PWR (C11.2 D24.1 R56.2 U3.5)
GND: extension (P1.4 P2.5 P2.6), IO (12 pins), led (20 pins), COM (5 pins), uc (25 pins), sensor (R61.1), PWR (8 pins)
A1: led (U2.5), uc (U4.9)
B1: led (U2.3), uc (U4.11)
BUTTON_1: IO (C6.2 R3.2 S1.2 S1.3), uc (U4.26)
BUTTON_2: IO (C7.2 R6.2 S2.2 S2.3), uc (U4.25)
BUTTON_3: IO (C8.2 R9.2 S3.2 S3.3), uc (U4.24)
C1: led (U2.2), uc (U4.14)
D1: led (U2.4), uc (U4.10)
DIG_1: led (R35.1), uc (U4.34)
DIG_2: led (R36.1), uc (U4.35)
DIG_3: led (R37.1), uc (U4.36)
DIG_4: led (R38.1), uc (U4.39)
DP: led (R21.1), uc (U4.16)
L1_L2: led (R19.2), uc (U4.17)
L3: led (R18.2), uc (U4.33)
LD_1: led (U2.1), uc (U4.15)
LED_1: led (R39.2), uc (U4.23)
LED_2: led (R41.2), uc (U4.22)
LED_3: led (R43.2), uc (U4.21)
LED_4: led (R45.2), uc (U4.4)
LED_5: led (R47.2), uc (U4.3)
LED_6: led (R49.2), uc (U4.2)
LED_7: led (R51.2), uc (U4.62)
LED_8: led (R53.2), uc (U4.61)
MISO: extension (P1.2), uc (U4.52)
MOSI: extension (P1.3), uc (U4.53)
PH_1: led (U2.6), uc (U4.8)
RELAY_1: IO (R2.2), uc (U4.29)
RELAY_2: IO (R5.2), uc (U4.28)
RELAY_3: IO (R8.2), uc (U4.27)
RELAY_4: IO (R11.2), uc (U4.54)
RELAY_5: IO (R13.2), uc (U4.56)
RELAY_6: IO (R15.2), uc (U4.57)
RGB_B: led (R34.1), uc (U4.41)
RGB_G: led (R33.1), uc (U4.45)
RGB_R: led (R32.1), uc (U4.44)
SCK: extension (P1.1), uc (U4.51)
SCL: extension (P2.1), uc (U4.58)
SDA: extension (P2.3), uc (U4.59)
TEMP: uc (U4.20), sensor (P10.1 R57.2 R61.2)
USART6_RX: extension (P2.2), uc (U4.38)
USART6_TX: extension (P2.4), uc (U4.37)
USART_RX: COM (U1.14), uc (U4.43)
USART_TX: COM (U1.13), uc (U4.42)